# Altium schematic sheet USB.SchDoc
size A; DocumentNumber: 4; SheetNumber: 4; SheetTotal: 6
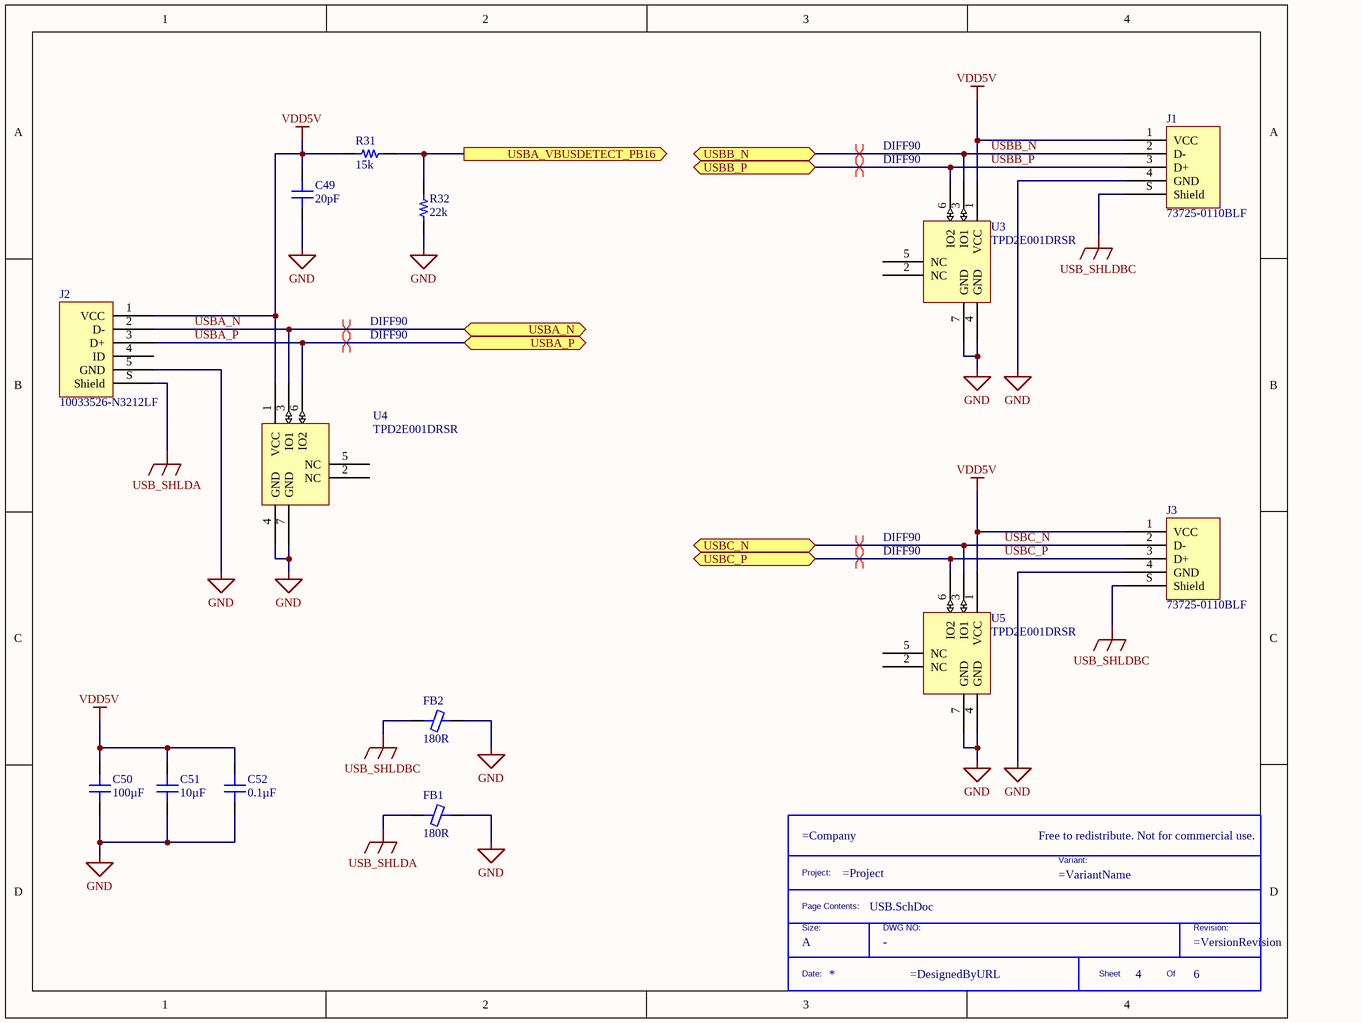
[diagram p0: USB.SchDoc]

## Parts
*  Size: A  (hidden comment: TitleBlock)  (graphical)
C49  20pF  [CAP 0402_1005]
C50  100µF  [CAP 1210_3225 - 2.8MM]
C51  10µF  [CAP 0805_2012]
C52  0.1µF  [CAP 0402_1005]
FB1  180R  [FER 0603_1608]
FB2  180R  [FER 0603_1608]
J1  73725-0110BLF  [AMPHENOL USB 73725-0110BLF]
J2  10033526-N3212LF  [FCI USB 10033526-N3212LF]
J3  73725-0110BLF  [AMPHENOL USB 73725-0110BLF]
R31  15k  [RES 0402_1005]
R32  22k  [RES 0402_1005]
U3  TPD2E001DRSR  [SON95P300X80_HS-7N]
U4  TPD2E001DRSR  [SON95P300X80_HS-7N]
U5  TPD2E001DRSR  [SON95P300X80_HS-7N]

## Ports
USBA_N (bidir), USBA_P (bidir), USBA_VBUSDETECT_PB16 (out), USBB_N (bidir), USBB_P (bidir), USBC_N (bidir), USBC_P (bidir)

## Nets
GND: C49.1 C50.1 C51.1 C52.2 FB1.1 FB2.1 J1.4(GND) J2.5(GND) J3.4(GND) R32.1 U3.4(GND) U3.7(GND) U4.4(GND) U4.7(GND) U5.4(GND) U5.7(GND)
USB_SHLDA: FB1.2 J2.S(Shield)
USB_SHLDBC: FB2.2 J1.S(Shield) J3.S(Shield)
VDD5V: C49.2 C50.2 C51.2 C52.1 J1.1(VCC) J2.1(VCC) J3.1(VCC) R31.1 U3.1(VCC) U4.1(VCC) U5.1(VCC)
USBA_N: J2.2(D-) U4.3(IO1) ; port USBA_N
USBA_P: J2.3(D+) U4.6(IO2) ; port USBA_P
USBA_VBUSDETECT_PB16: R31.2 R32.2 ; port USBA_VBUSDETECT_PB16
USBB_N: J1.2(D-) U3.3(IO1) ; port USBB_N
USBB_P: J1.3(D+) U3.6(IO2) ; port USBB_P
USBC_N: J3.2(D-) U5.3(IO1) ; port USBC_N
USBC_P: J3.3(D+) U5.6(IO2) ; port USBC_P

Not connected (* = marked no-connect by the designer): J2 4(ID); U3 2(NC) 5(NC); U4 2(NC) 5(NC); U5 2(NC) 5(NC)

## Layout directives
differential pair; differential pair class DIFF90: USBA_N, USBA_P, USBB_N, USBB_P, USBC_N, USBC_P

## Notes on the sheet
- (in symbol TitleBlock) Free to redistribute. Not for commercial use.; Project:; Variant:; Page Contents:; Size:; DWG NO:; Revision:; Date:; Sheet; Of

## Library data of the parts
* = TitleBlock: Custom Title Block; DWG: -
C49 = GJM1555C1H200FB01D: CAP CER 20PF 50V C0G/NP0 0402; Manufacturer: Murata Electronics; Temperature Coefficient: C0G, NP0; Tolerance: ±1%; Part Number: GJM1555C1H200FB01D; Value: 20pF; Applications: RF, Microwave, High Frequency; Capacitance: 20pF; ComponentLink1Description: Datasheet; ComponentLink1URL: https://search.murata.co.jp/Ceramy/image/img/A01X/G101/ENG/GJM1555C1H200FB01-01.pdf; ComponentLink2Description: DigiKey Link; ComponentLink2URL: http://digikey.com/product-detail/en/murata-electronics/GJM1555C1H200FB01D/490-11204-1-ND/5333044; Device Package: 0402 (1005 Metric); Features: High Q, Low Loss; LastUpdated: 9/2/2020 1:02:17 AM; Lifecycle Status: Active; Minimum Order: 1; Mounting Type: Surface Mount, MLCC; Operating Temperature: -55°C ~ 125°C; Package / Case: 0402 (1005 Metric); Packaging: TapeAndReel; PartId: 4905; Part Status: Active; Price: 0.04; Series: GJM; Size / Dimension: 0.039" L x 0.020" W (1.00mm x 0.50mm); Supplier 1: DigiKey; Supplier Part Number 1: 490-11204-1-ND; Thickness (Max): 0.022" (0.55mm); Voltage - Rated: 50V
C50 = LMK325ABJ107MMHP: CAP CER 100UF 10V X5R 1210; Manufacturer: Taiyo Yuden; Tolerance: ±20%; Part Number: LMK325ABJ107MMHP; Value: 100µF; Applications: Automotive; Capacitance: 100µF; ComponentLink1Description: Datasheet; ComponentLink1URL: https://ds.yuden.co.jp/TYCOMPAS/ut/detail?pn=LMK325ABJ107MMHP &u=M; ComponentLink2Description: DigiKey Link; ComponentLink2URL: http://digikey.com/product-detail/en/taiyo-yuden/LMK325ABJ107MMHP/587-5467-1-ND/7067143; Device Package: 1210 (3225 Metric); LastUpdated: 9/2/2020 1:10:52 AM; Lifecycle Status: Active; Minimum Order: 1; Mounting Type: Surface Mount, MLCC; Operating Temperature: -55°C ~ 85°C; Package / Case: 1210 (3225 Metric); Packaging: TapeAndReel; PartId: 23688; Part Status: Active; Price: 0.49; Series: M; Size / Dimension: 0.126" L x 0.098" W (3.20mm x 2.50mm); Supplier 1: DigiKey; Supplier Part Number 1: 587-5467-1-ND; Temperature Coefficient: X5R; Thickness (Max): 0.110" (2.80mm); Voltage - Rated: 10V
C51 = CL21A106KPCLQNC: CAP CER 10UF 10V X5R 0805; Manufacturer: Samsung Electro-Mechanics; Tolerance: ±10%; Part Number: CL21A106KPCLQNC; Value: 10µF; Applications: General Purpose; Capacitance: 10µF; ComponentLink1Description: Datasheet; ComponentLink1URL: http://www.samsungsem.com/kr/support/product-search/mlcc/CL21A106KPCLQNC.jsp; ComponentLink2Description: DigiKey Link; ComponentLink2URL: http://digikey.com/product-detail/en/samsung-electro-mechanics/CL21A106KPCLQNC/1276-2402-1-ND/3890488; Device Package: 0805 (2012 Metric); LastUpdated: 9/2/2020 1:04:19 AM; Lifecycle Status: Active; Minimum Order: 1; Mounting Type: Surface Mount, MLCC; Operating Temperature: -55°C ~ 85°C; Package / Case: 0805 (2012 Metric); Packaging: TapeAndReel; PartId: 14319; Part Status: Active; Price: 0.03; Series: CL; Size / Dimension: 0.079" L x 0.049" W (2.00mm x 1.25mm); Supplier 1: DigiKey; Supplier Part Number 1: 1276-2402-1-ND; Temperature Coefficient: X5R; Thickness (Max): 0.037" (0.95mm); Voltage - Rated: 10V
C52 = C0402C104K4PACTU: CAP CER 0.1UF 16V X5R 0402; Manufacturer: KEMET; Tolerance: ±10%; Part Number: C0402C104K4PACTU; Value: 0.1µF; Applications: General Purpose; Capacitance: 0.1µF; ComponentLink1Description: Datasheet; ComponentLink1URL: https://api.kemet.com/component-edge/download/datasheet/C0402C104K4PACTU.pdf; ComponentLink2Description: DigiKey Link; ComponentLink2URL: http://digikey.com/product-detail/en/kemet/C0402C104K4PACTU/399-7762-1-ND/3471485; Device Package: 0402 (1005 Metric); LastUpdated: 9/2/2020 1:02:03 AM; Lifecycle Status: Active; Minimum Order: 1; Mounting Type: Surface Mount, MLCC; Operating Temperature: -55°C ~ 85°C; Package / Case: 0402 (1005 Metric); Packaging: TapeAndReel; PartId: 11334; Part Status: Active; Price: 0.01; Series: SMD Comm X5R; Size / Dimension: 0.039" L x 0.020" W (1.00mm x 0.50mm); Supplier 1: DigiKey; Supplier Part Number 1: 399-7762-1-ND; Temperature Coefficient: X5R; Thickness (Max): 0.022" (0.55mm); Voltage - Rated: 16V
FB1 FB2 = MPZ1608S181ATAH0: FERRITE BEAD 180 OHM 0603 1LN; Manufacturer: TDK Corporation; Current Rating (Max): 2A; DC Resistance (DCR) (Max): 50mOhm; Filter Type: Power Line; Impedance @ Frequency: 180 Ohms @ 100MHz; Number of Lines: 1; Part Number: MPZ1608S181ATAH0; ComponentLink1Description: Datasheet; ComponentLink1URL: https://product.tdk.com/info/en/catalog/datasheets/beads_commercial_power_mpz1608_en.pdf?ref_disty=digikey; ComponentLink2Description: DigiKey Link; ComponentLink2URL: http://digikey.com/product-detail/en/tdk-corporation/MPZ1608S181ATAH0/445-5220-1-ND/2117954; Device Package: 0603 (1608 Metric); Height (Max): 0.030" (0.75mm); LastUpdated: 9/2/2020 1:18:17 AM; Lifecycle Status: Active; Minimum Order: 1; Mounting Type: Surface Mount; Operating Temperature: -55°C ~ 125°C; Package / Case: 0603 (1608 Metric); Packaging: TapeAndReel; PartId: 1025; Part Status: Active; Price: 0.02; Series: MPZ; Size / Dimension: 0.063" L x 0.032" W (1.60mm x 0.80mm); Supplier 1: DigiKey; Supplier Part Number 1: 445-5220-1-ND; Value: 180R
J1 J3 = 73725-0110BLF: CONN RCPT USB2.0 TYPEA 4POS R/A; Manufacturer: Amphenol ICC (FCI); Connector Type: USB - A; Current Rating (Amps): 2.5A; Gender: Receptacle; Mating Cycles: 1500; Number of Contacts: 4; Number of Ports: 1; Shielding: Shielded; Part Number: 73725-0110BLF; ComponentLink1Description: Datasheet; ComponentLink1URL: http://www.amphenol-icc.com/media/wysiwyg/files/drawing/73725.pdf; ComponentLink2Description: DigiKey Link; ComponentLink2URL: http://digikey.com/product-detail/en/amphenol-icc-fci/73725-0110BLF/609-1041-ND/1001355; Features: Board Lock; LastUpdated: 4/30/2020 11:56:05 AM; Lifecycle Status: Active; Minimum Order: 1; Mounting Feature: Vertical; Mounting Type: Through Hole, Right Angle; Operating Temperature: -55°C ~ 85°C; Packaging: Tube; Part Status: Active; Price: 0.91; Series: 73725; Specifications: USB 2.0; Supplier 1: DigiKey; Supplier Part Number 1: 609-1041-ND; Termination: Solder
J2 = 10033526-N3212LF: CONN RCPT MINI USB B 5POS SMD RA; Manufacturer: Amphenol ICC (FCI); Connector Type: USB - mini B; Current Rating (Amps): 1A per Contact; Gender: Receptacle; Mating Cycles: 5000; Number of Contacts: 5; Number of Ports: 1; Shielding: Shielded; Voltage - Rated: 30V; Part Number: 10033526-N3212LF; ComponentLink1Description: Datasheet; ComponentLink1URL: http://www.amphenol-icc.com/media/wysiwyg/files/drawing/10033526.pdf; ComponentLink2Description: DigiKey Link; ComponentLink2URL: //digikey.com/product-detail/en/amphenol-icc-fci/10033526-N3212LF/609-4700-2-ND/4292074; Features: Board Guide, Solder Retention; LastUpdated: 12/9/2019 8:52:14 PM; Lifecycle Status: 0; Minimum Order: 1; Mounting Feature: Horizontal; Mounting Type: Surface Mount, Right Angle; Operating Temperature: -25°C ~ 85°C; Packaging: TapeAndReel; Part Status: Active; Price: 0.39; Series: -; Supplier 1: DigiKey; Supplier Part Number 1: 609-4700-2-ND; Termination: Solder
R31 = ERJ-PA2F1502X: RES SMD 15K OHM 1% 1/5W 0402; Manufacturer: Panasonic Electronic Components; Power (Watts): 0.2W, 1/5W; Resistance: 15 kOhms; Temperature Coefficient: ±100ppm/°C; Part Number: ERJ-PA2F1502X; Value: 15k; ComponentLink1Description: Datasheet; ComponentLink1URL: https://industrial.panasonic.com/cdbs/www-data/pdf/RDO0000/AOA0000C331.pdf; ComponentLink2Description: DigiKey Link; ComponentLink2URL: http://digikey.com/product-detail/en/panasonic-electronic-components/ERJ-PA2F1502X/P17231CT-ND/5402719; Composition: Thick Film; Device Package: 0402 (1005 Metric); Features: Automotive AEC-Q200, Pulse Withstanding; Height - Seated (Max): 0.016" (0.40mm); LastUpdated: 9/2/2020 1:07:58 AM; Lifecycle Status: Active; Minimum Order: 1; Number of Terminations: 2; Operating Temperature: -55°C ~ 155°C; Package / Case: 0402 (1005 Metric); Packaging: TapeAndReel; PartId: 7876; Part Status: Active; Price: 0.02; Ratings: AEC-Q200; Series: ERJ; Size / Dimension: 0.039" L x 0.020" W (1.00mm x 0.50mm); Supplier 1: DigiKey; Supplier Part Number 1: P17231CT-ND; Supplier Device Package: 0402; Tolerance: ±1%
R32 = CR0402-FX-2202GLF: RES SMD 22K OHM 1% 1/16W 0402; Manufacturer: Bourns Inc.; Power (Watts): 0.063W, 1/16W; Resistance: 22 kOhms; Temperature Coefficient: ±100ppm/°C; Part Number: CR0402-FX-2202GLF; Value: 22k; ComponentLink1Description: Datasheet; ComponentLink1URL: https://www.bourns.com/docs/Product-Datasheets/CR0402.pdf; ComponentLink2Description: DigiKey Link; ComponentLink2URL: http://digikey.com/product-detail/en/bourns-inc/CR0402-FX-2202GLF/CR0402-FX-2202GLFCT-ND/4247665; Composition: Thick Film; Device Package: 0402 (1005 Metric); Height - Seated (Max): 0.016" (0.40mm); LastUpdated: 9/2/2020 1:08:01 AM; Lifecycle Status: Active; Minimum Order: 1; Number of Terminations: 2; Operating Temperature: -55°C ~ 155°C; Package / Case: 0402 (1005 Metric); Packaging: CutTape; PartId: 6638; Part Status: Active; Price: 0.10; Series: CR0402; Size / Dimension: 0.039" L x 0.020" W (1.00mm x 0.50mm); Supplier 1: DigiKey; Supplier Part Number 1: CR0402-FX-2202GLFCT-ND; Supplier Device Package: 0402; Tolerance: ±1%
U3-U5 = TPD2E001DRSR: Dual 1.5-pF, 5.5-V, ±8-kV ESD protection diode with 1-nA max leakage & VCC pin for USB 2.0 6-SON -40 to 85; Manufacturer: Texas Instruments; Direction: Unidirectional; Operating Supply Voltage: 5.5V; Number of Channels: 2; Capacitance: 1.5pF; Min Breakdown Voltage: 11V; Power Line Protection: Yes; Clamping Voltage: 105.5V; Max Reverse Leakage Current: 1nA; Test Current: 10mA; Interface: LVDS,USB,Ethernet; Supplier 1: Arrow Electronics; Manufacturer Part Number: TPD2E001DRSR; RoHS: Yes; Category: Interface ICs; Stock 1: 1000; Pricing 1: 1=0.61530, 10=0.52960, 25=0.52440, 100=0.39900, 250=0.39500, 500=0.27490, 1000=0.24620, 1000=0.21900, 2000=0.21460 (USD); Number of Pins: 6; Contact Plating: Gold; Min Operating Temperature: -40°C; Max Operating Temperature: 85°C; Packaging: Tape and Reel; Package Quantity: 1; Number of Bidirectional Channels: 2; Reverse Standoff Voltage: 5.5V; Termination: SMD/SMT; ESD Protection: Yes; Leakage Current: 1nA; Element Configuration: Dual; Length: 3mm; Width: 1.3mm; Height: 0.55mm; Depth: 3mm; Radiation Hardening: No; REACH SVHC: No SVHC; Lead Free: Lead Free; RoHS Compliant: Yes; ComponentLink1URL: https://datasheet.ciiva.com/15134/getdatasheetpartid-321682-15134763.pdf?src-supplier=Verical; ComponentLink1Description: https://datasheet.ciiva.com/15134/getdatasheetpartid-321682-15134763.pdf?src-supplier=Verical; ComponentLink2URL: https://datasheet.ciiva.com/1268/1851973-1268376.pdf?src-supplier=Element14; ComponentLink2Description: https://datasheet.ciiva.com/1268/1851973-1268376.pdf?src-supplier=Element14; ComponentLink3URL: https://datasheet.ciiva.com/339/tpd2e001-339042.pdf?src-supplier=Digi-Key; ComponentLink3Description: https://datasheet.ciiva.com/339/tpd2e001-339042.pdf?src-supplier=Digi-Key; ComponentLink4URL: https://datasheet.ciiva.com/339/tpd2e001-339041.pdf?src-supplier=Digi-Key; ComponentLink4Description: https://datasheet.ciiva.com/339/tpd2e001-339041.pdf?src-supplier=Digi-Key; ComponentLink5URL: https://datasheet.ciiva.com/339/tpd2e001-339043.pdf?src-supplier=Digi-Key; ComponentLink5Description: https://datasheet.ciiva.com/339/tpd2e001-339043.pdf?src-supplier=Digi-Key; ComponentLink6URL: https://datasheet.ciiva.com/25955/tpd2e001-25955452.pdf?src-supplier=Avnet+Europe; ComponentLink6Description: https://datasheet.ciiva.com/25955/tpd2e001-25955452.pdf?src-supplier=Avnet+Europe; Supplier Part Number 1: TPD2E001DRSR